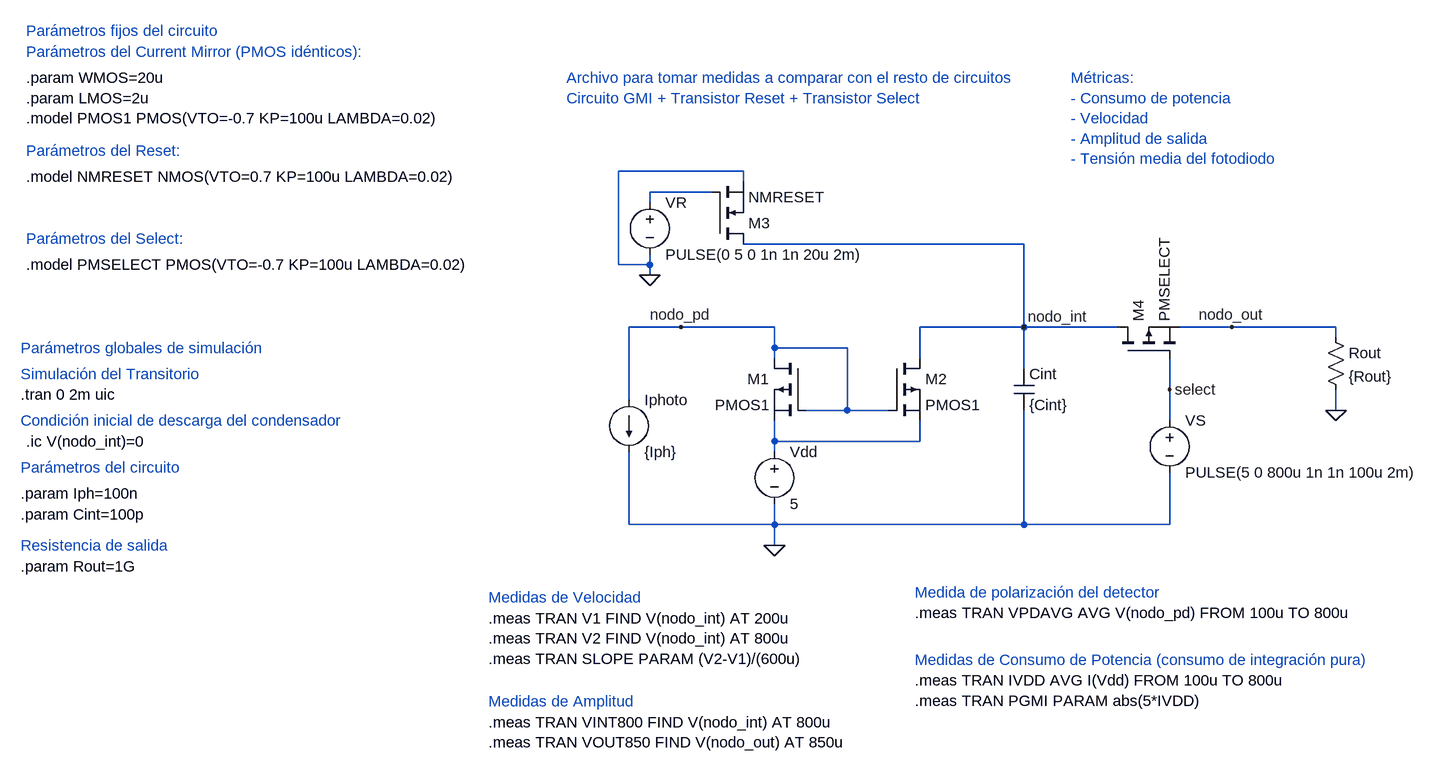
[diagram p0: schematic GMI_Comp.asc]
GMI_Comp.asc, the LTspice schematic file:
Version 4.1
SHEET 1 1756 1184
WIRE 336 224 144 224
WIRE 336 240 336 224
WIRE 288 256 192 256
WIRE 192 272 192 256
WIRE 768 336 336 336
WIRE 144 368 144 224
WIRE 192 368 192 352
WIRE 192 368 144 368
WIRE 192 384 192 368
WIRE 240 464 160 464
WIRE 384 464 240 464
WIRE 768 464 768 336
WIRE 768 464 608 464
WIRE 912 464 768 464
WIRE 1088 464 1008 464
WIRE 1248 464 1088 464
WIRE 1248 480 1248 464
WIRE 384 496 384 464
WIRE 496 496 384 496
WIRE 384 512 384 496
WIRE 608 512 608 464
WIRE 768 528 768 464
WIRE 992 560 992 512
WIRE 160 576 160 464
WIRE 496 592 496 496
WIRE 496 592 432 592
WIRE 560 592 496 592
WIRE 1248 592 1248 560
WIRE 992 608 992 560
WIRE 384 640 384 608
WIRE 608 640 608 608
WIRE 608 640 384 640
WIRE 384 656 384 640
WIRE 160 768 160 656
WIRE 384 768 384 736
WIRE 384 768 160 768
WIRE 768 768 768 592
WIRE 768 768 384 768
WIRE 992 768 992 688
WIRE 992 768 768 768
WIRE 384 800 384 768
FLAG 384 800 0
FLAG 768 464 nodo_int
FLAG 192 384 0
FLAG 1088 464 nodo_out
FLAG 992 560 select
FLAG 1248 592 0
FLAG 240 464 nodo_pd
SYMBOL voltage 384 640 R0
WINDOW 123 0 0 Left 0
WINDOW 39 0 0 Left 0
SYMATTR InstName Vdd
SYMATTR Value 5
SYMBOL current 160 576 R0
SYMATTR InstName Iphoto
SYMATTR Value {Iph}
SYMBOL cap 752 528 R0
SYMATTR InstName Cint
SYMATTR Value {Cint}
SYMBOL pmos 560 512 R0
SYMATTR InstName M2
SYMATTR Value PMOS1
SYMATTR SpiceLine L={LMOS} W={WMOS}
SYMBOL pmos 432 512 M0
SYMATTR InstName M1
SYMATTR Value PMOS1
SYMATTR SpiceLine L={LMOS} W={WMOS}
SYMBOL voltage 192 256 R0
SYMATTR InstName VR
SYMATTR Value PULSE(0 5 0 1n 1n 20u 2m)
SYMBOL nmos 288 336 M180
SYMATTR InstName M3
SYMATTR Value NMRESET
SYMATTR SpiceLine L={LMOS} W={WMOS}
SYMBOL pmos 912 512 R270
SYMATTR InstName M4
SYMATTR Value PMSELECT
SYMATTR SpiceLine L={LMOS} W={WMOS}
SYMBOL voltage 992 592 R0
SYMATTR InstName VS
SYMATTR Value PULSE(5 0 800u 1n 1n 100u 2m)
SYMBOL res 1232 464 R0
SYMATTR InstName Rout
SYMATTR Value {Rout}
TEXT 64 80 Left 2 ;Archivo para tomar medidas a comparar con el resto de circuitos\nCircuito GMI + Transistor Reset + Transistor Select
TEXT -768 80 Left 2 !.param WMOS=20u\n.param LMOS=2u\n.model PMOS1 PMOS(VTO=-0.7 KP=100u LAMBDA=0.02)
TEXT -768 40 Left 2 ;Parámetros del Current Mirror (PMOS idénticos):
TEXT -776 568 Left 2 !.tran 0 2m uic
TEXT -768 640 Left 2 !.ic V(nodo_int)=0
TEXT -776 608 Left 2 ;Condición inicial de descarga del condensador
TEXT -768 192 Left 2 ;Parámetros del Reset:
TEXT -768 232 Left 2 !.model NMRESET NMOS(VTO=0.7 KP=100u LAMBDA=0.02)
TEXT -768 368 Left 2 !.model PMSELECT PMOS(VTO=-0.7 KP=100u LAMBDA=0.02)
TEXT -768 328 Left 2 ;Parámetros del Select:
TEXT -776 832 Left 2 !.param Rout=1G
TEXT -768 8 Left 2 ;Parámetros fijos del circuito
TEXT -776 496 Left 2 ;Parámetros globales de simulación
TEXT -776 536 Left 2 ;Simulación del Transitorio
TEXT -776 720 Left 2 !.param Iph=100n
TEXT -776 680 Left 2 ;Parámetros del circuito
TEXT -776 752 Left 2 !.param Cint=100p
TEXT -776 800 Left 2 ;Resistencia de salida
TEXT -56 880 Left 2 ;Medidas de Velocidad
TEXT -56 912 Left 2 !.meas TRAN V1 FIND V(nodo_int) AT 200u\n.meas TRAN V2 FIND V(nodo_int) AT 800u\n.meas TRAN SLOPE PARAM (V2-V1)/(600u)
TEXT -56 1040 Left 2 ;Medidas de Amplitud
TEXT -56 1072 Left 2 !.meas TRAN VINT800 FIND V(nodo_int) AT 800u\n.meas TRAN VOUT850 FIND V(nodo_out) AT 850u
TEXT 600 872 Left 2 ;Medida de polarización del detector
TEXT 600 904 Left 2 !.meas TRAN VPDAVG AVG V(nodo_pd) FROM 100u TO 800u
TEXT 600 976 Left 2 ;Medidas de Consumo de Potencia (consumo de integración pura)
TEXT 840 80 Left 2 ;Métricas:\n- Consumo de potencia\n- Velocidad\n- Amplitud de salida\n- Tensión media del fotodiodo
TEXT 600 1008 Left 2 !.meas TRAN IVDD AVG I(Vdd) FROM 100u TO 800u\n.meas TRAN PGMI PARAM abs(5*IVDD)

The netlist it stands for:
* GMI_Comp.asc
Vdd N002 0 5
Iphoto nodo_pd 0 {Iph}
Cint nodo_int 0 {Cint}
M2 nodo_int nodo_pd N002 N002 PMOS1 L={LMOS} W={WMOS}
M1 nodo_pd nodo_pd N002 N002 PMOS1 L={LMOS} W={WMOS}
VR N001 0 PULSE(0 5 0 1n 1n 20u 2m)
M3 nodo_int N001 0 0 NMRESET L={LMOS} W={WMOS}
M4 nodo_int select nodo_out nodo_out PMSELECT L={LMOS} W={WMOS}
VS select 0 PULSE(5 0 800u 1n 1n 100u 2m)
Rout nodo_out 0 {Rout}
.model NMOS NMOS
.model PMOS PMOS
.lib standard.mos
* Archivo para tomar medidas a comparar con el resto de circuitos
* Circuito GMI + Transistor Reset + Transistor Select
.param WMOS=20u
.param LMOS=2u
.model PMOS1 PMOS(VTO=-0.7 KP=100u LAMBDA=0.02)
* Parámetros del Current Mirror (PMOS idénticos):
.tran 0 2m uic
.ic V(nodo_int)=0
* Condición inicial de descarga del condensador
* Parámetros del Reset:
.model NMRESET NMOS(VTO=0.7 KP=100u LAMBDA=0.02)
.model PMSELECT PMOS(VTO=-0.7 KP=100u LAMBDA=0.02)
* Parámetros del Select:
.param Rout=1G
* Parámetros fijos del circuito
* Parámetros globales de simulación
* Simulación del Transitorio
.param Iph=100n
* Parámetros del circuito
.param Cint=100p
* Resistencia de salida
* Medidas de Velocidad
.meas TRAN V1 FIND V(nodo_int) AT 200u
.meas TRAN V2 FIND V(nodo_int) AT 800u
.meas TRAN SLOPE PARAM (V2-V1)/(600u)
* Medidas de Amplitud
.meas TRAN VINT800 FIND V(nodo_int) AT 800u
.meas TRAN VOUT850 FIND V(nodo_out) AT 850u
* Medida de polarización del detector
.meas TRAN VPDAVG AVG V(nodo_pd) FROM 100u TO 800u
* Medidas de Consumo de Potencia (consumo de integración pura)
* Métricas:
* - Consumo de potencia
* - Velocidad
* - Amplitud de salida
* - Tensión media del fotodiodo
.meas TRAN IVDD AVG I(Vdd) FROM 100u TO 800u
.meas TRAN PGMI PARAM abs(5*IVDD)
.backanno
.end

* Results of the author's LTspice run, read from the files saved beside the schematic
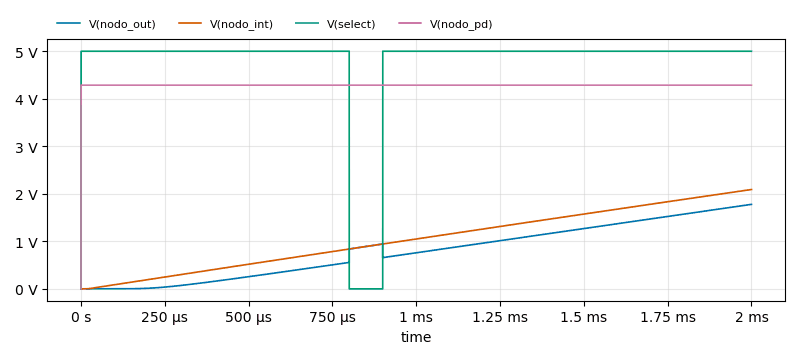
[diagram p1: Transient Analysis of GMI_Comp.asc, plotted from the saved traces]
* Transient Analysis, 1 run:
*   V(nodo_out): min 0 V, max 1.778 V, average 793.5 mV, rms 970.7 mV, last 1.778 V
*   V(nodo_int): min 0 V, max 2.09 V, average 1.045 V, rms 1.209 V, last 2.09 V
*   V(select): min 0 V, max 5 V, average 4.75 V, rms 4.873 V, last 5 V
*   V(nodo_pd): min 0 V, max 4.286 V, average 4.286 V, rms 4.286 V, last 4.286 V
* From the log:
*   v1: V(nodo_int) =0.194900382049 at 0.0002
*   v2: V(nodo_int) =0.837950587273 at 0.0008
*   slope: (V2-V1)/(600u)=1071.75034204
*   vint800: V(nodo_int) =0.837950587273 at 0.0008
*   vout850: V(nodo_out) =0.890889564686 at 0.00085
*   vpdavg: AVG(V(nodo_pd) )=4.28595781326 FROM 0.0001 TO 0.0008
*   ivdd: AVG(I(Vdd) )=-2.07544704478e-07 FROM 0.0001 TO 0.0008
*   pgmi: abs(5*IVDD)=1.03772352239e-06